# Altium schematic sheet Sh_Headers.SchDoc
size A4
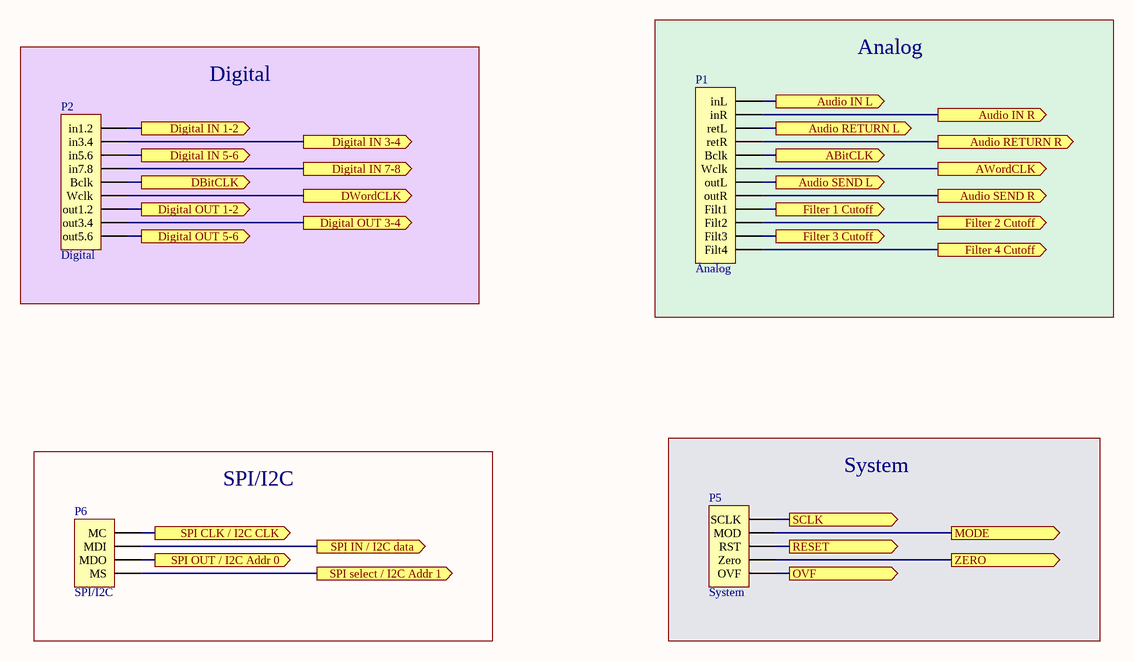
[diagram p0: Sh_Headers.SchDoc]

## Parts
P1  Analog  [HDR1X12]
P2  Digital  [HDR1X9]
P5  System  [HDR1X5]
P6  SPI/I2C  [HDR1X4]

## Blocks framed on the sheet
Digital: P2
Analog: P1
SPI/I2C: P6
System: P5

## Ports
ABitCLK (out), Audio IN L (out), Audio IN R (out), Audio RETURN L (out), Audio RETURN R (out), Audio SEND L (out), Audio SEND R (out), AWordCLK (out), DBitCLK (out), Digital IN 1-2 (out), Digital IN 3-4 (out), Digital IN 5-6 (out), Digital IN 7-8 (out), Digital OUT 1-2 (out), Digital OUT 3-4 (out), Digital OUT 5-6 (out), DWordCLK (out), Filter 1 Cutoff (out), Filter 2 Cutoff (out), Filter 3 Cutoff (out), Filter 4 Cutoff (out), MODE (out), OVF (out), RESET (out), SCLK (out), SPI CLK / I2C CLK (out), SPI IN / I2C data (out), SPI OUT / I2C Addr 0 (out), SPI select / I2C Addr 1 (out), ZERO (out)

## Nets
ABitCLK: P1.5(Bclk) ; port ABitCLK
Audio IN L: P1.1(inL) ; port Audio IN L
Audio IN R: P1.2(inR) ; port Audio IN R
Audio RETURN L: P1.3(retL) ; port Audio RETURN L
Audio RETURN R: P1.4(retR) ; port Audio RETURN R
Audio SEND L: P1.7(outL) ; port Audio SEND L
Audio SEND R: P1.8(outR) ; port Audio SEND R
AWordCLK: P1.6(Wclk) ; port AWordCLK
DBitCLK: P2.5(Bclk) ; port DBitCLK
Digital IN 1-2: P2.1(in1.2) ; port Digital IN 1-2
Digital IN 3-4: P2.2(in3.4) ; port Digital IN 3-4
Digital IN 5-6: P2.3(in5.6) ; port Digital IN 5-6
Digital IN 7-8: P2.4(in7.8) ; port Digital IN 7-8
Digital OUT 1-2: P2.7(out1.2) ; port Digital OUT 1-2
Digital OUT 3-4: P2.8(out3.4) ; port Digital OUT 3-4
Digital OUT 5-6: P2.9(out5.6) ; port Digital OUT 5-6
DWordCLK: P2.6(Wclk) ; port DWordCLK
Filter 1 Cutoff: P1.9(Filt1) ; port Filter 1 Cutoff
Filter 2 Cutoff: P1.10(Filt2) ; port Filter 2 Cutoff
Filter 3 Cutoff: P1.11(Filt3) ; port Filter 3 Cutoff
Filter 4 Cutoff: P1.12(Filt4) ; port Filter 4 Cutoff
MODE: P5.4(MOD) ; port MODE
OVF: P5.1(OVF) ; port OVF
RESET: P5.3(RST) ; port RESET
SCLK: P5.5(SCLK) ; port SCLK
SPI CLK / I2C CLK: P6.4(MC) ; port SPI CLK / I2C CLK
SPI IN / I2C data: P6.3(MDI) ; port SPI IN / I2C data
SPI OUT / I2C Addr 0: P6.2(MDO) ; port SPI OUT / I2C Addr 0
SPI select / I2C Addr 1: P6.1(MS) ; port SPI select / I2C Addr 1
ZERO: P5.2(Zero) ; port ZERO

## Library data of the parts
P1 = Header 12: Header, 12-Pin; LatestRevisionDate: 17-Jul-2002; LatestRevisionNote: Re-released for DXP Platform.; Publisher: Altium Limited
P2 = Header 9: Header, 9-Pin; LatestRevisionDate: 17-Jul-2002; LatestRevisionNote: Re-released for DXP Platform.; Publisher: Altium Limited
P5 = Header 5: Header, 5-Pin; LatestRevisionDate: 17-Jul-2002; LatestRevisionNote: Re-released for DXP Platform.; Publisher: Altium Limited
P6 = Header 4: Header, 4-Pin; LatestRevisionDate: 17-Jul-2002; LatestRevisionNote: Re-released for DXP Platform.; Publisher: Altium Limited